# Altium schematic sheet COM_JTAG.SchDoc
size 558 x 431 mm
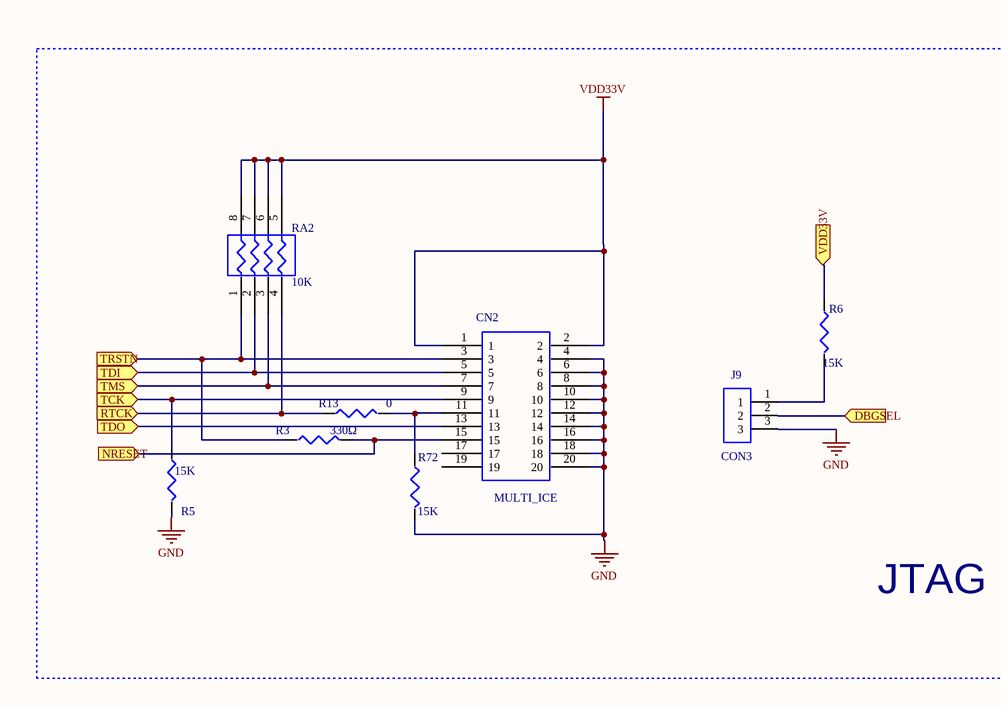
[diagram p0: COM_JTAG.SchDoc, top left]
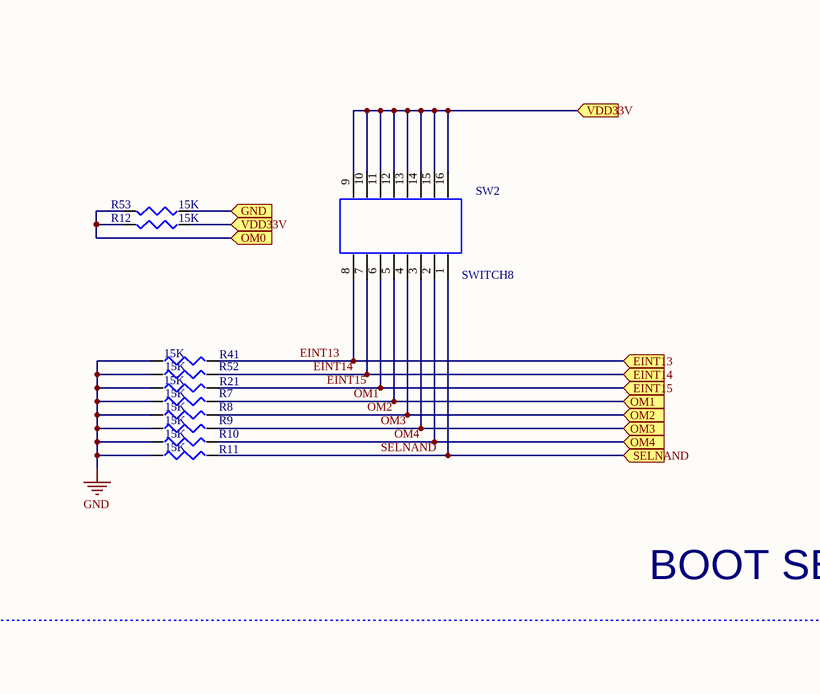
[diagram p1: COM_JTAG.SchDoc, top right]
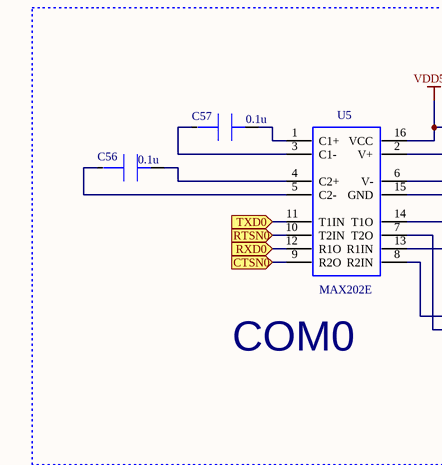
[diagram p2: COM_JTAG.SchDoc, bottom left]
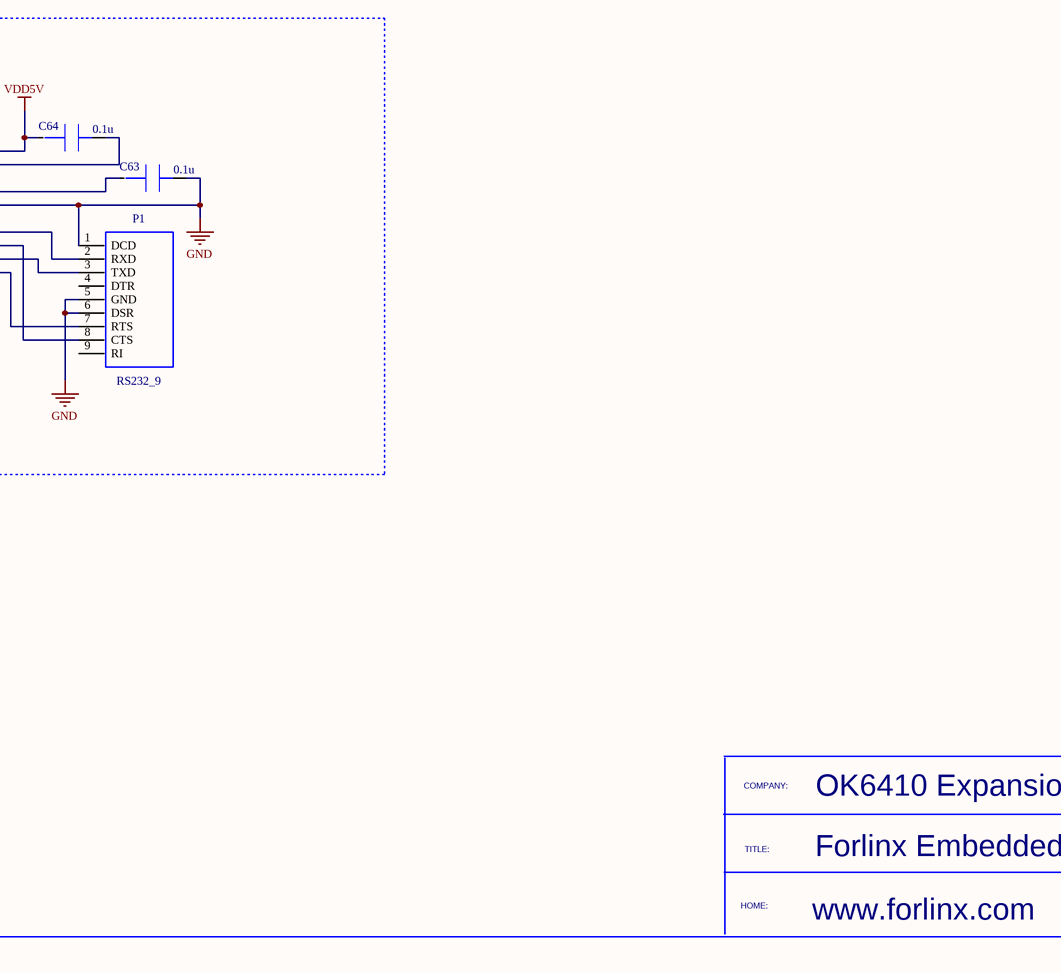
[diagram p3: COM_JTAG.SchDoc, bottom right]

## Parts
C56  value 0.1u  (hidden comment: CAP1206)
C57  value 0.1u  (hidden comment: CAP1206)
C63  value 0.1u  (hidden comment: CAP1206)
C64  value 0.1u  (hidden comment: CAP1206)
CN2  MULTI_ICE
J9  CON3
P1  RS232_9
R3  value 330Ω  (hidden comment: RESISTOR_2)
R5  value 15K  (hidden comment: RESISTOR_2)
R6  value 15K  (hidden comment: RESISTOR_2)
R7  value 15K  (hidden comment: RESISTOR_2)
R8  value 15K  (hidden comment: RESISTOR_2)
R9  value 15K  (hidden comment: RESISTOR_2)
R10  value 15K  (hidden comment: RESISTOR_2)
R11  value 15K  (hidden comment: RESISTOR_2)
R12  value 15K  (hidden comment: RESISTOR_2)
R13  value 0  (hidden comment: R)
R21  value 15K  (hidden comment: RESISTOR_2)
R41  value 15K  (hidden comment: RESISTOR_2)
R52  value 15K  (hidden comment: RESISTOR_2)
R53  value 15K  (hidden comment: RESISTOR_2)
R72  value 15K  (hidden comment: RESISTOR_2)
RA2  value 10K  (hidden comment: RP4R)
SW2  SWITCH8
U5  MAX202E

## Blocks framed on the sheet
JTAG: CN2 J9 R3 R5 R6 R13 R72 RA2
BOOT SELECT: R7-R12 R21 R41 R52 R53 SW2
COM0: C56 C57 C63 C64 P1 U5

## Ports
CTSN0, DBGSEL, EINT13, EINT14, EINT15, GND, NRESET, OM0, OM1, OM2, OM3, OM4, RTCK, RTSN0, RXD0, SELNAND, TCK, TDI, TDO, TMS, TRSTN, TXD0, VDD33V

## Nets
GND: C63.2 CN2.4 CN2.6 CN2.8 CN2.10 CN2.12 CN2.14 CN2.16 CN2.18 CN2.20 J9.3 P1.1(DCD) P1.5(GND) P1.6(DSR) R5.1 R7.1 R8.1 R9.1 R10.1 R11.1 R21.1 R41.1 R52.1 R72.1 U5.15(GND)
VDD5V: C64.1 U5.16(VCC)
VDD33V: CN2.1 CN2.2 RA2.5(R42) RA2.6(R32) RA2.7(R22) RA2.8(R11)
CTSN0: U5.9(R2O) ; port CTSN0
DBGSEL: J9.2 ; port DBGSEL
EINT13: R41.2 SW2.8 ; port EINT13
EINT14: R52.2 SW2.7 ; port EINT14
EINT15: R21.2 SW2.6 ; port EINT15
GND: R53.1 ; port GND  [a separate net that carries the same name]
NRESET: CN2.15 R3.1 ; port NRESET
OM0: R12.2 R53.2 ; port OM0
OM1: R7.2 SW2.5 ; port OM1
OM2: R8.2 SW2.4 ; port OM2
OM3: R9.2 SW2.3 ; port OM3
OM4: R10.2 SW2.2 ; port OM4
RTCK: R13.1 RA2.4(R41) ; port RTCK
RTSN0: U5.10(T2IN) ; port RTSN0
RXD0: U5.12(R1O) ; port RXD0
SELNAND: R11.2 SW2.1 ; port SELNAND
TCK: CN2.9 R5.2 ; port TCK
TDI: CN2.5 RA2.2(R21) ; port TDI
TDO: CN2.13 ; port TDO
TMS: CN2.7 RA2.3(R31) ; port TMS
TRSTN: CN2.3 R3.2 RA2.1(R12) ; port TRSTN
TXD0: U5.11(T1IN) ; port TXD0
VDD33V: R6.2 R12.1 SW2.9 SW2.10 SW2.11 SW2.12 SW2.13 SW2.14 SW2.15 SW2.16 ; port VDD33V  [a separate net that carries the same name]
NetC56_1: C56.1 U5.5(C2-)
NetC56_2: C56.2 U5.4(C2+)
NetC57_1: C57.1 U5.3(C1-)
NetC57_2: C57.2 U5.1(C1+)
NetC63_1: C63.1 U5.6(V-)
NetC64_2: C64.2 U5.2(V+)
NetCN2_11: CN2.11 R13.2 R72.2
NetJ9_1: J9.1 R6.1
NetP1_2: P1.2(RXD) U5.14(T1O)
NetP1_3: P1.3(TXD) U5.13(R1IN)
NetP1_7: P1.7(RTS) U5.8(R2IN)
NetP1_8: P1.8(CTS) U5.7(T2O)

Not connected (* = marked no-connect by the designer): CN2 17 19; P1 4(DTR) 9(RI)

## Notes on the sheet
- COMPANY:
- OK6410 Expansion Board
- TITLE:
- Forlinx Embedded
- HOME:
- www.forlinx.com

## Library data of the parts
C56 C57 C63 C64 = CAP1206: SURFACE MOUNT CAPACITOR 0.062 X 0.126 INCHES; Manufacturer #1: IPC SM-782 STD.; PCB DECAL: 0603A
CN2 = MULTI_ICE: PCB Footprint: 3F-20PA; PCB DECAL: IDC20S
J9 = CON3: PCB DECAL: SIP3S
P1 = RS232_9: PCB DECAL: DB9-HF
R3 R5-R12 R21 R41 R52 R53 R72 = RESISTOR_2: PCB Footprint: C2012; PCB DECAL: 0603A
R13 = R: PCB DECAL: 0603A
RA2 = RP4R: 1ST PART FIELD: 22; PCB Footprint: R-AR4; PCB DECAL: R-AR4
U5 = MAX202E: PCB DECAL: SO16NB
SW2 = SWITCH8: PCB DECAL: SWITCH8